# EAGLE design Bottom (EAGLE 9.3.0)

## Sheet 1 of 2: Power Supply
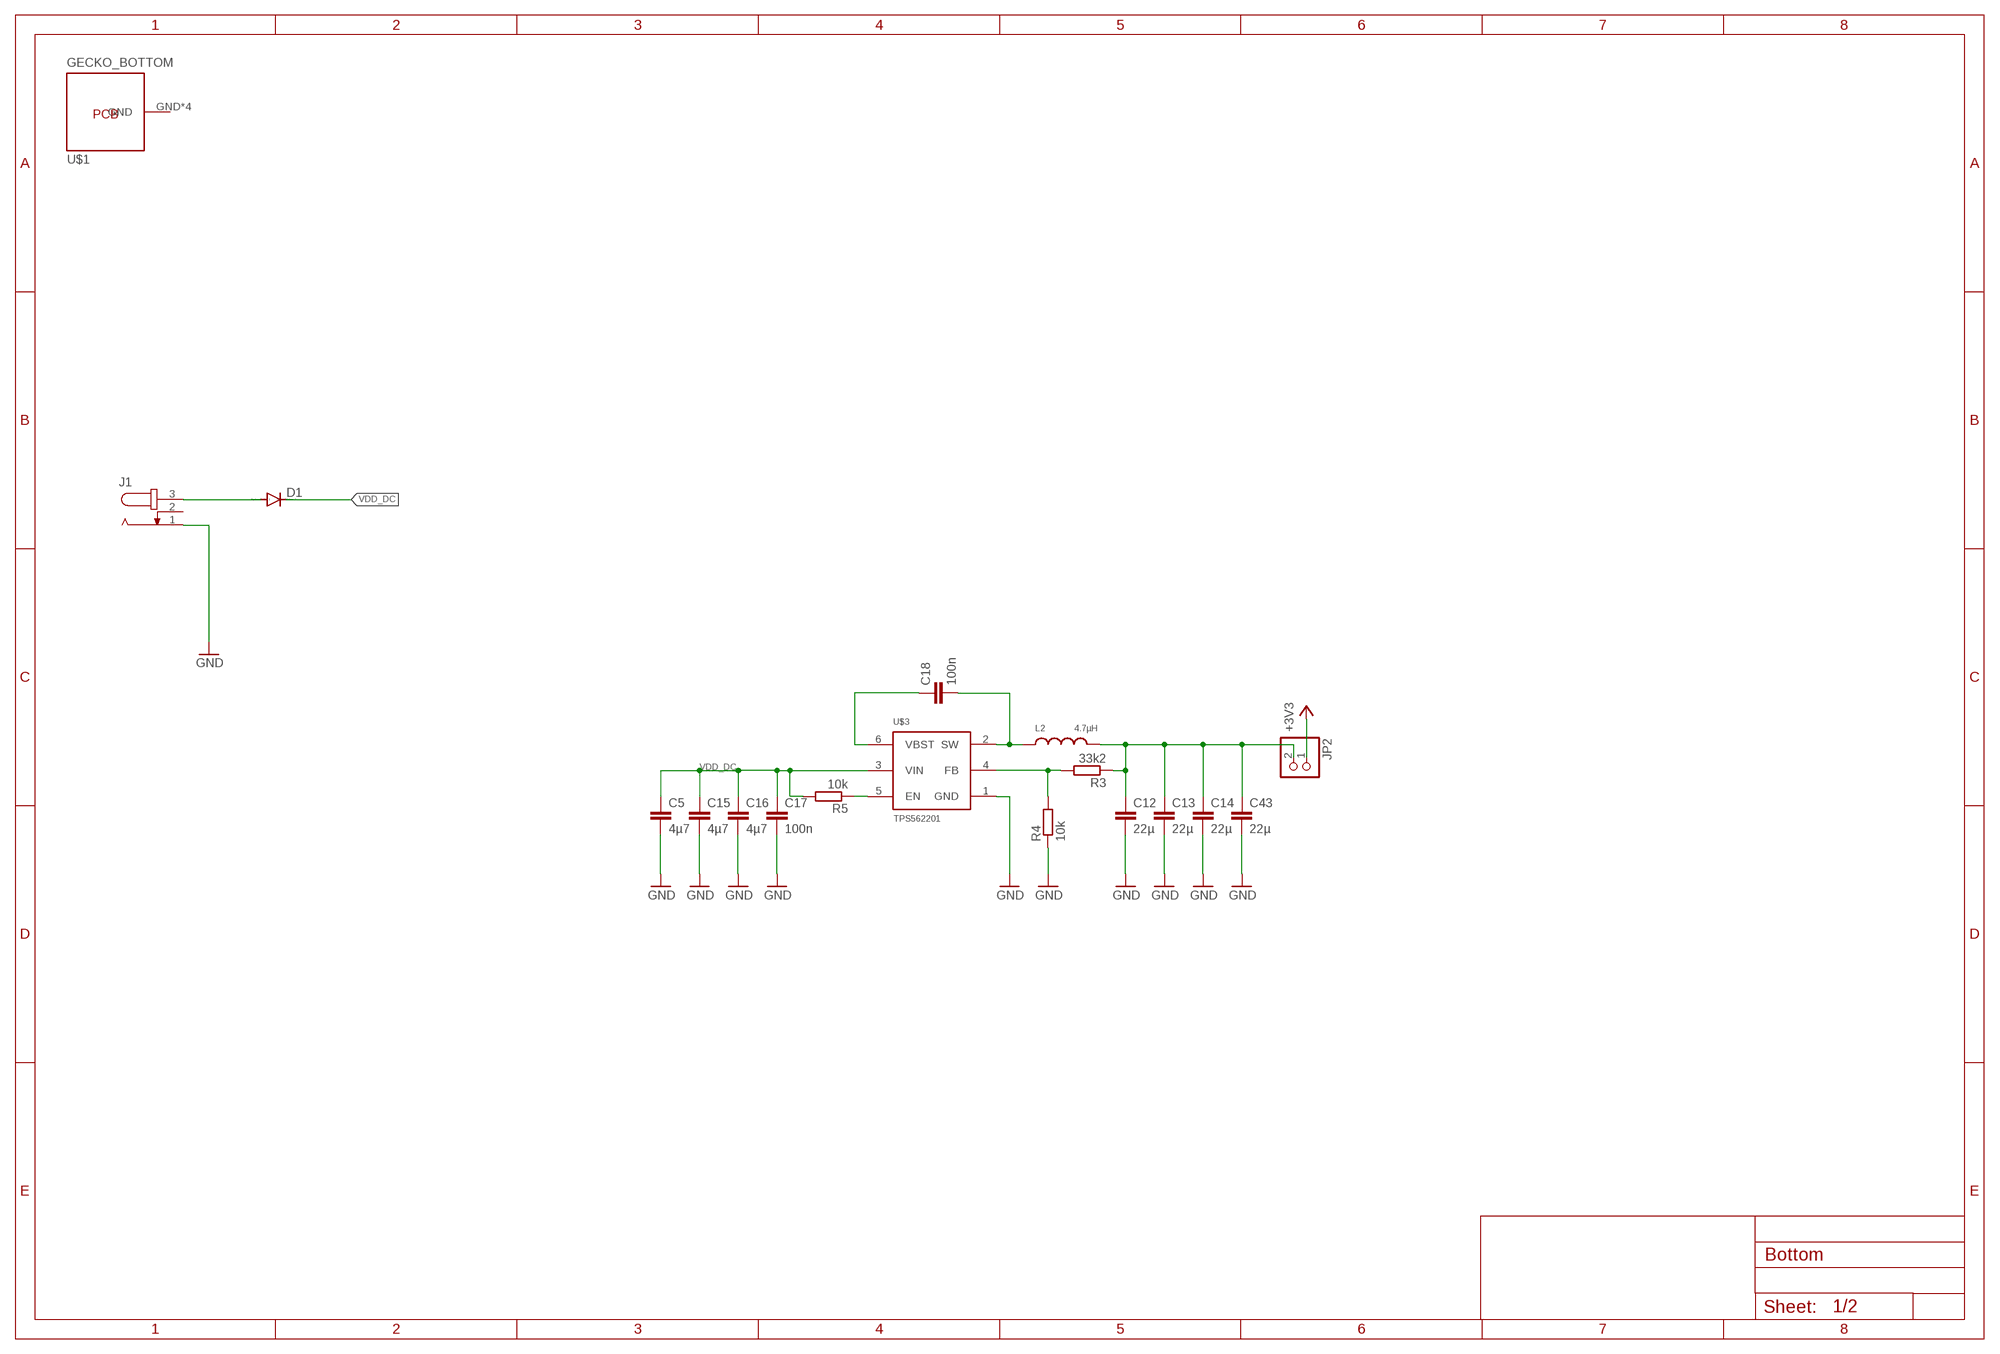
[diagram p0: schematic, sheet 1]

### Parts
C5  4µ7  C-EUC0805  [C0805]
C12  22µ  C-EUC0805  [C0805]
C13  22µ  C-EUC0805  [C0805]
C14  22µ  C-EUC0805  [C0805]
C15  4µ7  C-EUC0805  [C0805]
C16  4µ7  C-EUC0805  [C0805]
C17  100n  C-EUC0805  [C0805]
C18  100n  C-EUC0805  [C0805]
C43  22µ  C-EUC0805  [C0805]
D1  DIODE-SMB  [SMB]
J1  JACK-PLUG0  [SPC4077]
JP2  PINHD-1X2  [1X02]
L2  4.7µH  WE-MAPI_3020_74438336047  [WE-MAPI_3015/3020]
R3  33k2  R-EU_R0805  [R0805]
R4  10k  R-EU_R0805  [R0805]
R5  10k  R-EU_R0805  [R0805]
U$1  GECKO_BOTTOM  [GECKO_BOTTOM]
U$3  TPS562201  [SOT95P280X110-6]

### Nets
+3V3: JP2.1 ; also sheet 2
GND: C5.2 C12.2 C13.2 C14.2 C15.2 C16.2 C17.2 C43.2 J1.1 R4.1 U$3.1(GND) ; also sheet 2
N$7: D1.A J1.3
N$15: C18.1 U$3.6(VBST)
N$19: C18.2 L2.1 U$3.2(SW)
N$20: R3.2 R4.2 U$3.4(FB)
N$31: C12.1 C13.1 C14.1 C43.1 JP2.2 L2.2 R3.1
VDD_DC: C5.1 C15.1 C16.1 C17.1 D1.C R5.2 U$3.3(VIN)
VREG_VDD3V3_EN: R5.1 U$3.5(EN)
Unconnected: J1.2 U$1.GND U$1.GND1(GND) U$1.GND2(GND) U$1.GND3(GND)

## Sheet 2 of 2
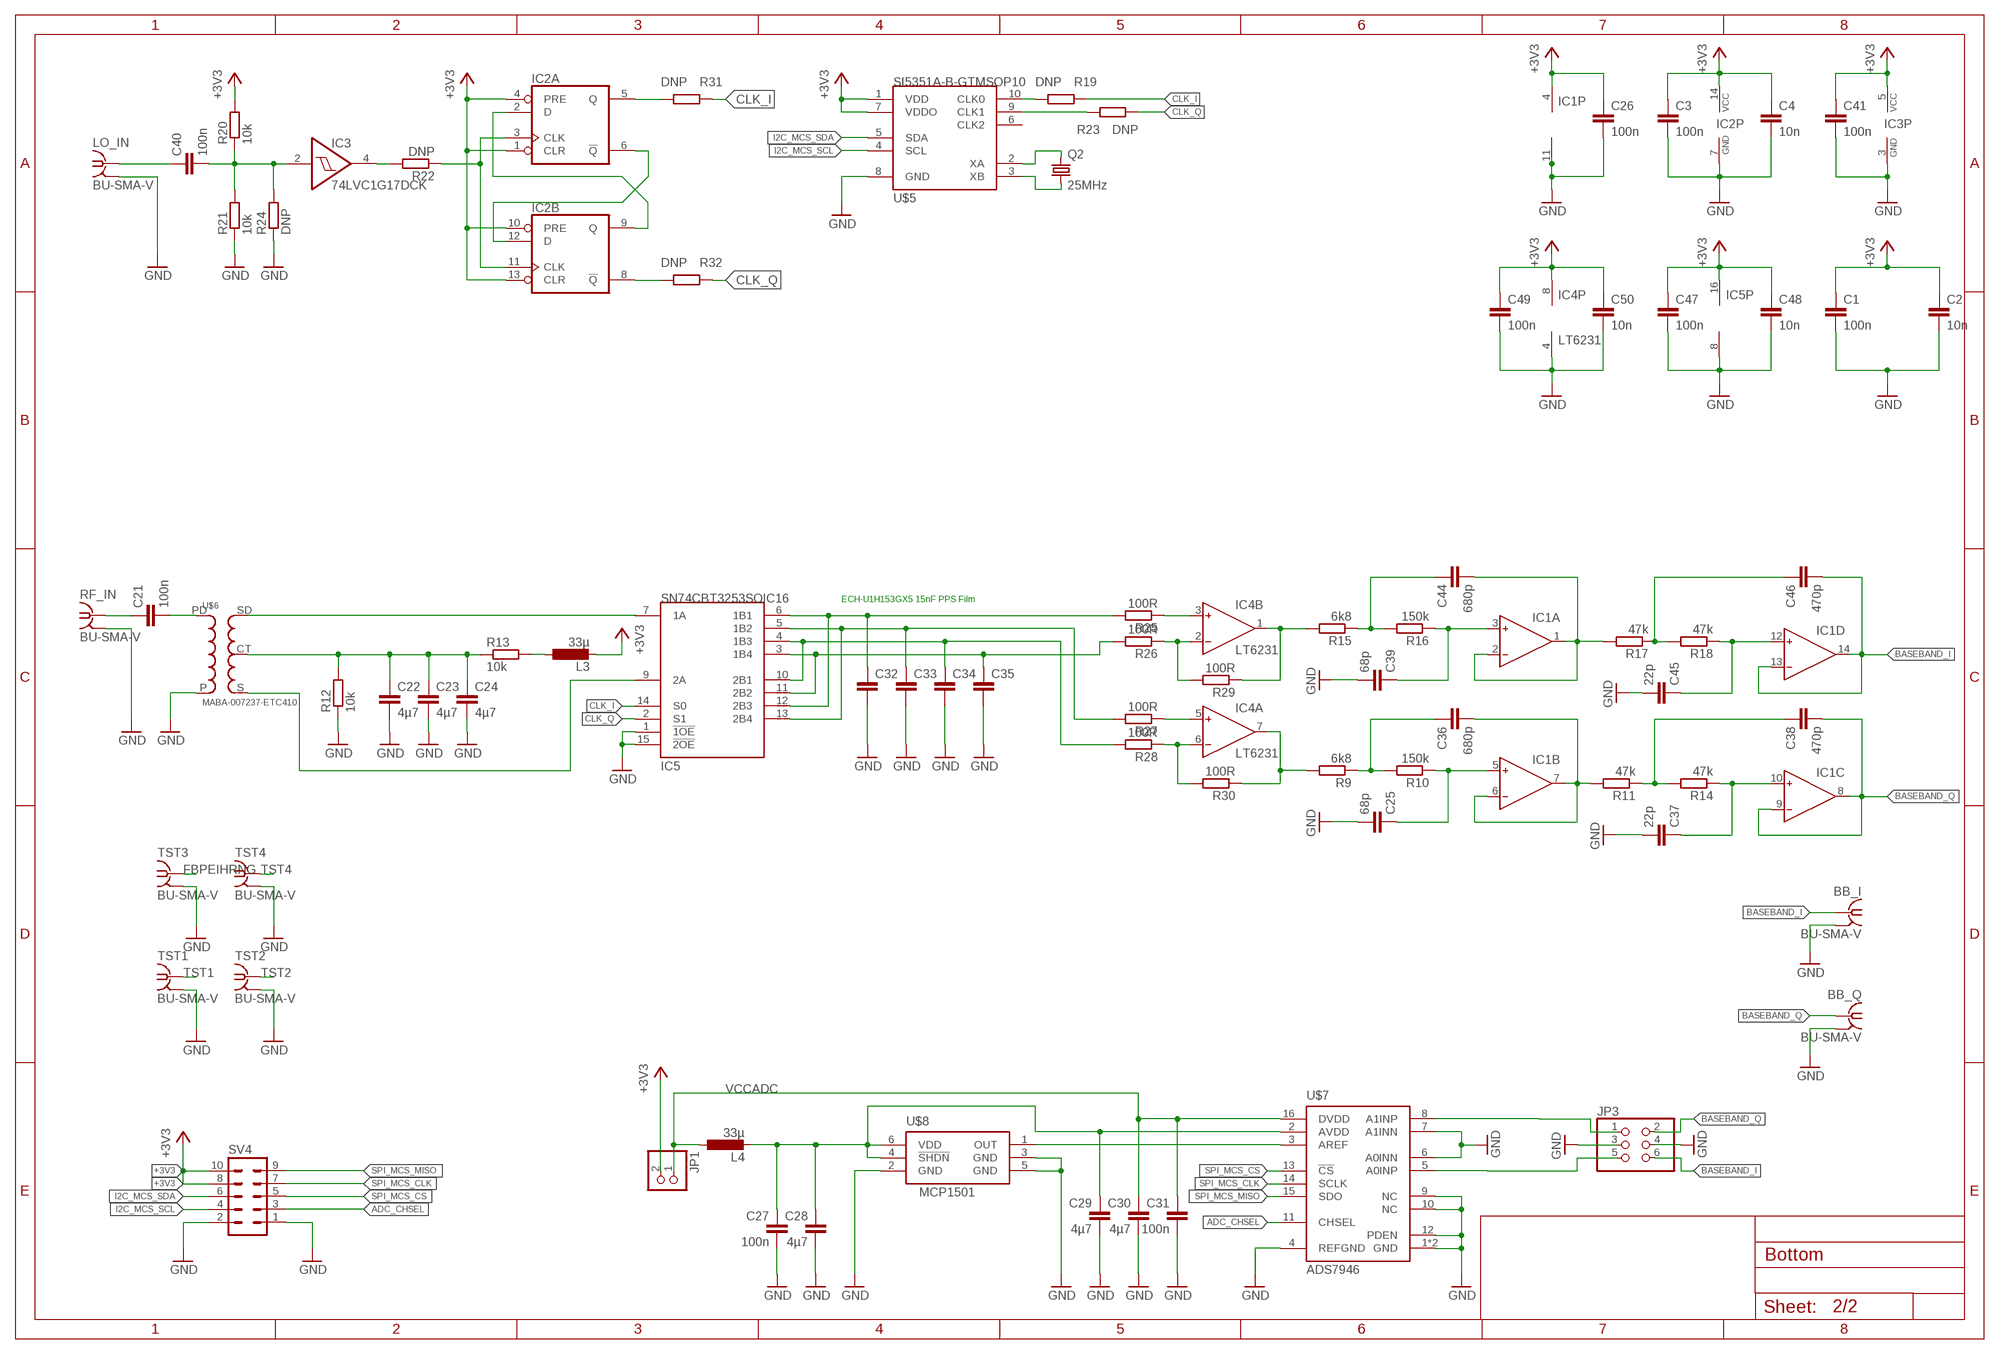
[diagram p1: schematic, sheet 2]

### Parts
BB_I  BU-SMA-V  [BU-SMA-V]
BB_Q  BU-SMA-V  [BU-SMA-V]
C1  100n  C-EUC0603  [C0603]
C2  10n  C-EUC0603  [C0603]
C3  100n  C-EUC0603  [C0603]
C4  10n  C-EUC0603  [C0603]
C21  100n  C-EUC0603  [C0603]
C22  4µ7  C-EUC0805  [C0805]
C23  4µ7  C-EUC0805  [C0805]
C24  4µ7  C-EUC0805  [C0805]
C25  68p  C-EUC0603  [C0603]
C26  100n  C-EUC0603  [C0603]
C27  100n  C-EUC0603  [C0603]
C28  4µ7  C-EUC0805  [C0805]
C29  4µ7  C-EUC0805  [C0805]
C30  4µ7  C-EUC0805  [C0805]
C31  100n  C-EUC0603  [C0603]
C32  C-EUC1206  [C1206]
C33  C-EUC1206  [C1206]
C34  C-EUC1206  [C1206]
C35  C-EUC1206  [C1206]
C36  680p  C-EUC0603  [C0603]
C37  22p  C-EUC0603  [C0603]
C38  470p  C-EUC0603  [C0603]
C39  68p  C-EUC0603  [C0603]
C40  100n  C-EUC0603  [C0603]
C41  100n  C-EUC0603  [C0603]
C44  680p  C-EUC0603  [C0603]
C45  22p  C-EUC0603  [C0603]
C46  470p  C-EUC0603  [C0603]
C47  100n  C-EUC0603  [C0603]
C48  10n  C-EUC0603  [C0603]
C49  100n  C-EUC0603  [C0603]
C50  10n  C-EUC0603  [C0603]
IC1  OP491SOIC_N14  [SOIC127P600X155-14]
IC2  74AC74D  [SO14]
IC3  74LVC1G17DCK  [SC70-5]
IC4  LT6231  [SO8]
IC5  SN74CBT3253SOIC16  [SOIC127P600X175-16]
JP1  PINHD-1X2  [1X02]
JP3  PINHD-2X3  [2X03]
L3  33µ  L-EUL2012C  [L2012C]
L4  33µ  L-EUL2012C  [L2012C]
LO_IN  BU-SMA-V  [BU-SMA-V]
Q2  25MHz  ABM10W-25.0000MHZ-6-B1U-T3  [ABM10W]
R9  6k8  R-EU_R0603  [R0603]
R10  150k  R-EU_R0603  [R0603]
R11  47k  R-EU_R0603  [R0603]
R12  10k  R-EU_R0603  [R0603]
R13  10k  R-EU_R0603  [R0603]
R14  47k  R-EU_R0603  [R0603]
R15  6k8  R-EU_R0603  [R0603]
R16  150k  R-EU_R0603  [R0603]
R17  47k  R-EU_R0603  [R0603]
R18  47k  R-EU_R0603  [R0603]
R19  DNP  R-EU_R0603  [R0603]
R20  10k  R-EU_R0603  [R0603]
R21  10k  R-EU_R0603  [R0603]
R22  DNP  R-EU_R0603  [R0603]
R23  DNP  R-EU_R0603  [R0603]
R24  DNP  R-EU_R0603  [R0603]
R25  100R  R-EU_R0603  [R0603]
R26  100R  R-EU_R0603  [R0603]
R27  100R  R-EU_R0603  [R0603]
R28  100R  R-EU_R0603  [R0603]
R29  100R  R-EU_R0603  [R0603]
R30  100R  R-EU_R0603  [R0603]
R31  DNP  R-EU_R0603  [R0603]
R32  DNP  R-EU_R0603  [R0603]
RF_IN  BU-SMA-V  [BU-SMA-V]
SV4  MA05-2  [MA05-2]
TST1  BU-SMA-V  [BU-SMA-V]
TST2  BU-SMA-V  [BU-SMA-V]
TST3  BU-SMA-V  [BU-SMA-V]
TST4  BU-SMA-V  [BU-SMA-V]
U$5  SI5351A-B-GTMSOP10  [SOP50P490X110-10]
U$6  MABA-007237-ETC410  [MABA-007237-ETC410]
U$7  ADS7946  [QFN50P300X300X80-17T170]
U$8  MCP1501  [SOT95P280X110-6]

### Nets
+3V3: C1.1 C2.1 C3.1 C4.1 C26.1 C41.1 C47.1 C48.1 C49.1 C50.1 IC1.4(P:V+) IC2.1(A:CLR) IC2.4(A:PRE) IC2.10(B:PRE) IC2.13(B:CLR) IC2.14(P:VCC) IC3.5(VCC) IC4.8(P:V+) IC5.16(V+) JP1.2 L3.2 R20.2 SV4.8 SV4.10 U$5.1(VDD) U$5.7(VDDO) ; also sheet 1
ADC_CHSEL: SV4.3 U$7.11(CHSEL)
BASEBAND_I: BB_I.1 C46.2 IC1.13(D:IN-) IC1.14(D:OUT) JP3.6
BASEBAND_Q: BB_Q.1 C38.2 IC1.8(C:OUT) IC1.9(C:IN-) JP3.2
CLK_I: IC5.14(S0) R19.1 R31.1
CLK_Q: IC5.2(S1) R23.1 R32.1
FBPEIHRNG: TST3.1
GND: BB_I.2 BB_I.3 BB_I.4 BB_I.5 BB_Q.2 BB_Q.3 BB_Q.4 BB_Q.5 C1.2 C2.2 C3.2 C4.2 C22.2 C23.2 C24.2 C25.2 C26.2 C27.2 C28.2 C29.2 C30.2 C31.2 C32.2 C33.2 C34.2 C35.2 C37.2 C39.2 C41.2 C45.2 C47.2 C48.2 C49.2 C50.2 IC1.11(P:V-) IC2.7(P:GND) IC3.3(GND) IC4.4(P:V-) IC5.1(!1OE) IC5.8(V-) IC5.15(!2OE) JP3.3 JP3.4 LO_IN.2 LO_IN.3 LO_IN.4 LO_IN.5 R12.1 R21.1 R24.1 RF_IN.2 RF_IN.3 RF_IN.4 RF_IN.5 SV4.1 SV4.2 TST1.2 TST1.3 TST1.4 TST1.5 TST2.2 TST2.3 TST2.4 TST2.5 TST3.2 TST3.3 TST3.4 TST3.5 TST4.2 TST4.3 TST4.4 TST4.5 U$5.8(GND) U$6.P U$7.1(GND) U$7.4(REFGND) U$7.6(A0INN) U$7.7(A1INN) U$7.9(NC) U$7.10(NC) U$7.12(PDEN) U$7.17(GND) U$8.2(GND) U$8.3(GND) U$8.5(GND) ; also sheet 1
I2C_MCS_SCL: SV4.4 U$5.4(SCL)
I2C_MCS_SDA: SV4.6 U$5.5(SDA)
N$1: R19.2 U$5.10(CLK0)
N$2: IC2.3(A:CLK) IC2.11(B:CLK) R22.1
N$3: IC2.6(A:!Q) IC2.12(B:D)
N$4: IC2.2(A:D) IC2.9(B:Q)
N$5: R23.2 U$5.9(CLK1)
N$6: IC4.7(A:OUT) R9.2 R30.1
N$10: C36.1 R9.1 R10.2
N$13: C25.1 IC1.5(B:IN+) R10.1
N$14: C36.2 IC1.6(B:IN-) IC1.7(B:OUT) R11.2
N$16: C21.1 RF_IN.1
N$17: C21.2 U$6.PD
N$18: C22.1 C23.1 C24.1 R12.2 R13.1 U$6.CT
N$21: L3.1 R13.2
N$22: IC4.3(B:IN+) R25.1
N$24: C32.1 IC5.6(1B1) IC5.12(2B3) R25.2
N$26: JP3.1 U$7.8(A1INP)
N$27: U$7.3(AREF) U$8.1(OUT)
N$29: C27.1 C28.1 C29.1 L4.2 U$7.2(AVDD) U$8.4(!SHDN) U$8.6(VDD)
N$32: JP3.5 U$7.5(A0INP)
N$33: C38.1 R11.1 R14.2
N$34: C34.1 IC5.4(1B3) IC5.10(2B1) R28.2
N$39: C37.1 IC1.10(C:IN+) R14.1
N$40: IC4.2(B:IN-) R26.1 R29.2
N$41: Q2.1 U$5.3(XB)
N$42: C44.1 R15.1 R16.2
N$43: C39.1 IC1.3(A:IN+) R16.1
N$44: C44.2 IC1.1(A:OUT) IC1.2(A:IN-) R17.2
N$45: IC4.5(A:IN+) R27.1
N$46: C40.1 LO_IN.1
N$47: C40.2 IC3.2(I) R20.1 R21.2 R24.2
N$48: IC3.4(O) R22.2
N$50: C46.1 R17.1 R18.2
N$51: IC5.9(2A) U$6.S
N$52: IC5.7(1A) U$6.SD
N$54: C45.1 IC1.12(D:IN+) R18.1
N$55: IC4.6(A:IN-) R28.1 R30.2
N$56: Q2.3 U$5.2(XA)
N$57: IC4.1(B:OUT) R15.2 R29.1
N$58: IC2.8(B:!Q) R32.2
N$59: IC2.5(A:Q) R31.2
N$128: C35.1 IC5.3(1B4) IC5.11(2B2) R26.2
N$130: C33.1 IC5.5(1B2) IC5.13(2B4) R27.2
SPI_MCS_CLK: SV4.7 U$7.14(SCLK)
SPI_MCS_CS: SV4.5 U$7.13(!CS)
SPI_MCS_MISO: SV4.9 U$7.15(SDO)
TST1: TST1.1
TST2: TST2.1
TST4: TST4.1
VCCADC: C30.1 C31.1 JP1.1 L4.1 U$7.16(DVDD)
Unconnected: U$5.6(CLK2)

### Notes on the sheet
- ECH-U1H153GX5 15nF PPS Film

## Library data of the parts
BB_I BB_Q LO_IN RF_IN TST1-TST4 = con-coax:BU-SMA-V: FEMALE SMA CONNECTOR Radiall distributor RS 112-3794; OC_FARNELL: unknown; OC_NEWARK: unknown
C1-C5 C12-C18 C21-C41 C43-C50 = rcl:C-EU: CAPACITOR, European symbol; SPICEPREFIX: C
D1 = diode:DIODE-: DIODE
IC1 = MyLib:OP491
IC2 = 74xx-eu:74*74: Dual D type positive edge triggered FLIP FLOP, preset and clear
IC3 = 74xx-little-de:74*1G17: Single Schmitt-Trigger Buffer
IC4 = MyLib:LT6231
IC5 = MyLib:SN74CBT3253
J1 = con-jack:JACK-PLUG: DC POWER JACK Power Jack, DC, Right Angle, Through Hole, Rated 5A at 16VDC, PC Terminals Distributor: Farnell (www.Farnell.de) Drawing: 84N1161.pdf / 84N1162.pdf Manufacturer: SPC Technology (www.spctechnology.com) Type: SPC4077 / SPC 4078; OC_FARNELL: unknown; OC_NEWARK: unknown
JP1 JP2 = pinhead:PINHD-1X2: PIN HEADER
JP3 = pinhead:PINHD-2X3: PIN HEADER
L2 = PowerMagnetics (rev18d):WE-MAPI_3020: SMD Metal Alloy Power Inductor Characteristics Magnetic iron alloy allows high rated currents Compact design Magnetically shielded High current capability and handles high transient current spikes Low acoustic noise and low leakage flux noise Operating temperature: –40 °C to 125 °C Applications DC/DC-converter for high current power supplies DC/DC-converter for Field Programmable Gate Array (FPGA) POL-converters Portable power like PDA, digital camera Mainboards/graphic cards Battery powered devices Wireless communication devices Power supplies for smartphones, tablet PCs and other mobile devices <http://katalog.we-online.de/media/images/v2/Family_WE-MAPI.jpg> Details see: http://katalog.we-online.de/en/pbs/WE-MAPI? Updated by Dan Xu 2014-07-08 2014 (C) Wurth Elektronik; WE-NUMBER: 74438336047/4,7uH
L3 L4 = rcl:L-EU: INDUCTOR, European symbol; SPICEPREFIX: L
Q2 = MyLib:ABM10W-25.0000MHZ-6-B1U-T3
R3-R5 R9-R32 = rcl:R-EU_: RESISTOR, European symbol; SPICEPREFIX: R
SV4 = con-lstb:MA05-2: PIN HEADER; OC_FARNELL: unknown; OC_NEWARK: unknown
U$1 = MyLib:GECKO_BOTTOM
U$3 = MyLib:TPS562201
U$5 = MyLib:SI5351A-B-GT
U$6 = MyLib:MABA-007237-ETC410
U$7 = MyLib:ADS7946
U$8 = MyLib:MCP1501

## Board
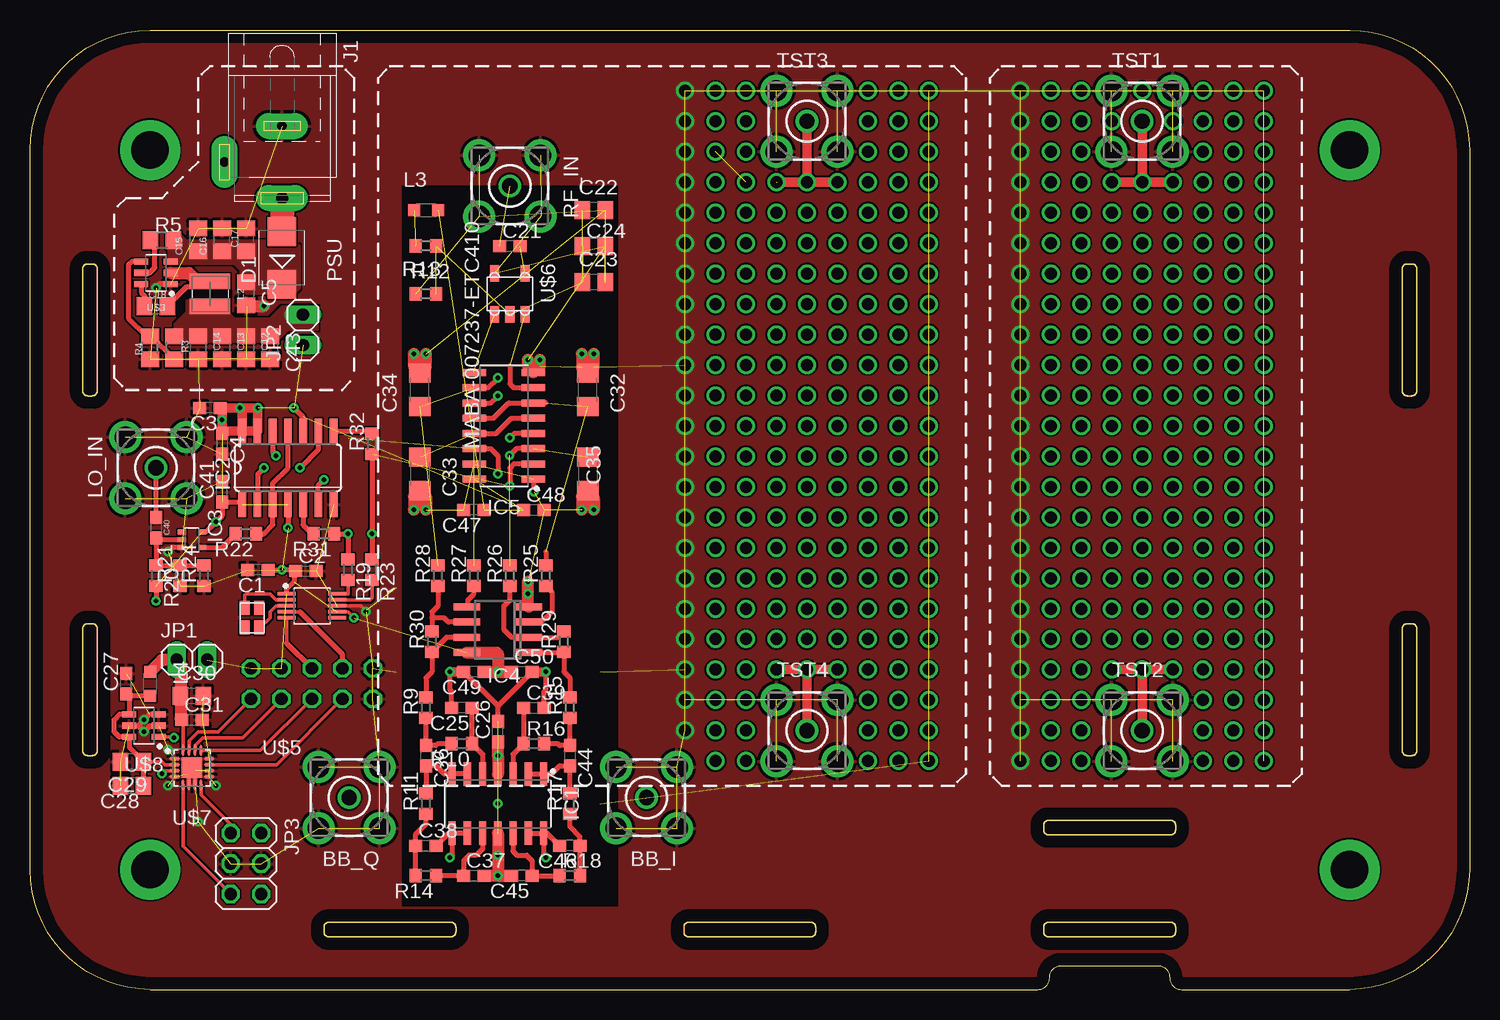
[diagram p2: board, top side]
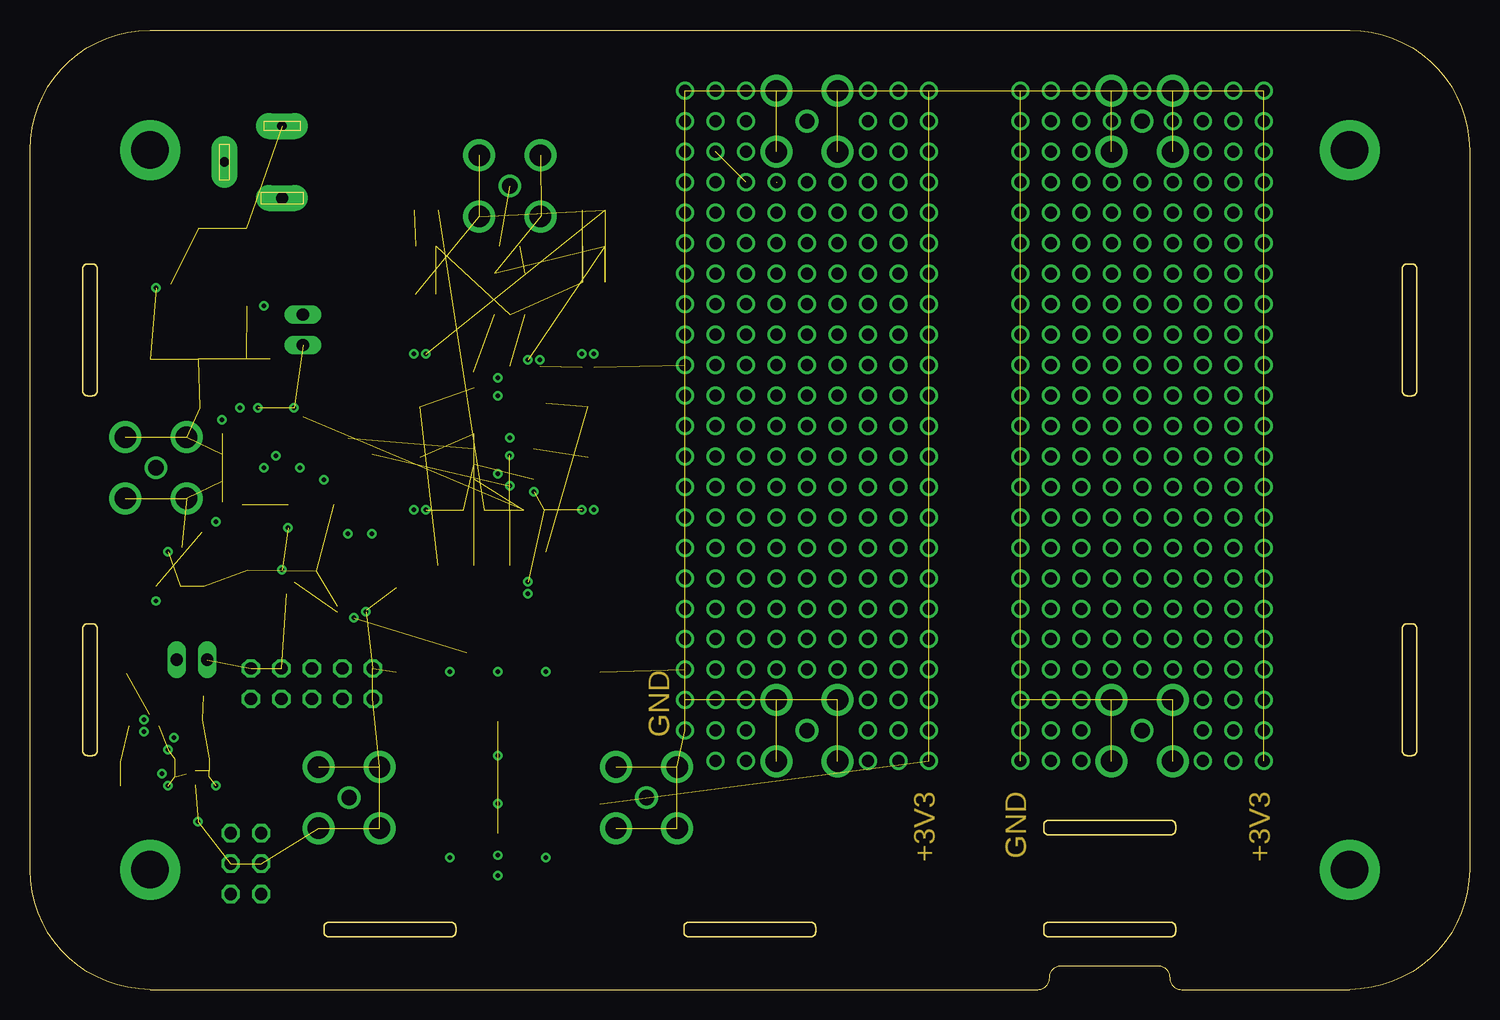
[diagram p3: board, inner layer Route2]
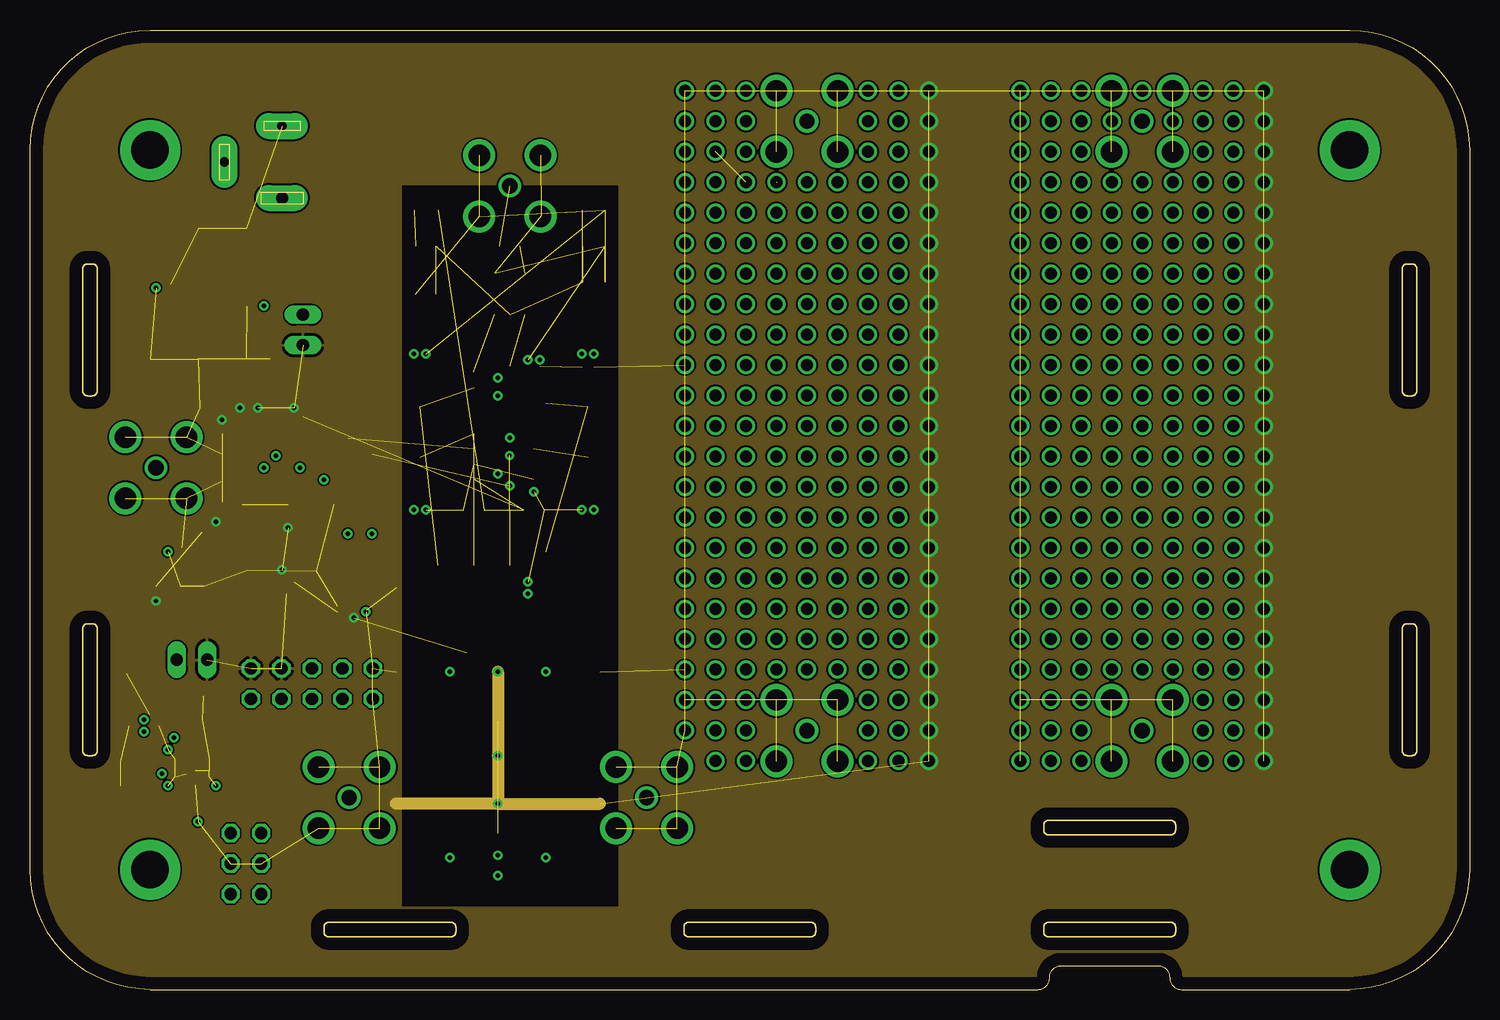
[diagram p4: board, inner layer Route15]
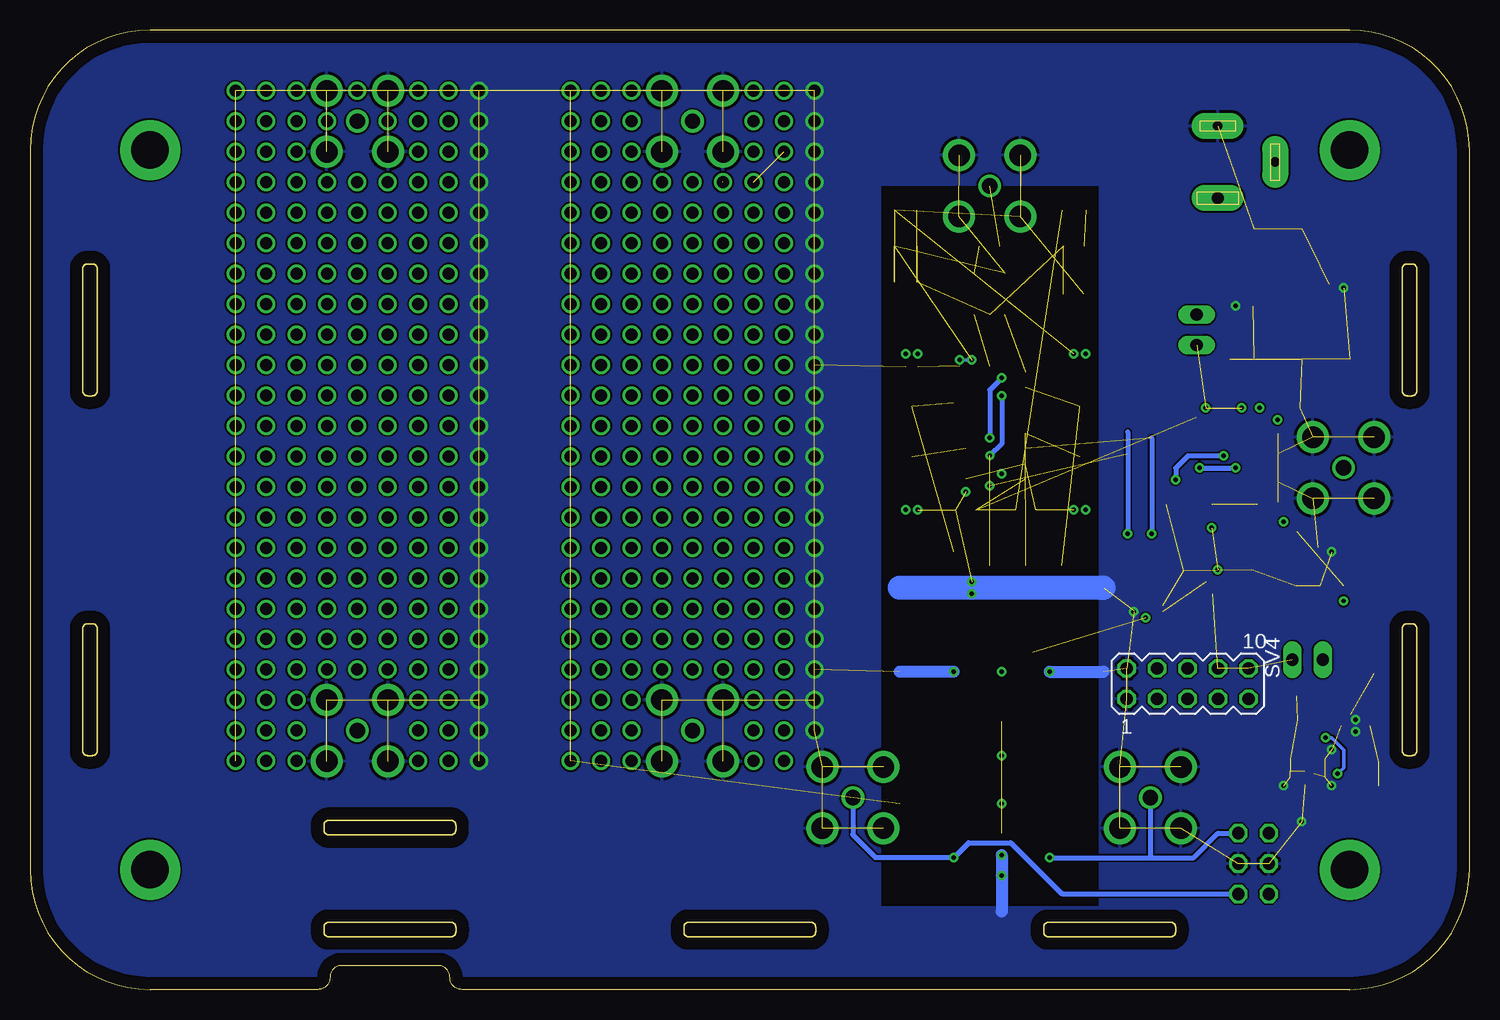
[diagram p5: board, bottom side, seen from below]

Size 120 x 80 mm. Coordinates in mm from the lower left corner, seen from the top.
Copper layers ([2:1+2*15+16:15]): Top 0.035mm / dielectric 1.5mm / Route2 0.035mm / dielectric 0.15mm / Route15 0.035mm / dielectric 0.2mm / Bottom 0.035mm
Design rules "default *": minimum track width 6mil, minimum drill 0.35mm, track to track 6mil, track to pad 6mil, pad to pad 6mil, via to via 6mil, smd to smd 6mil, copper to edge 40mil, drill to drill 6mil, minimum pad ring 10mil, minimum via ring 8mil, stop-mask expansion 4mil, vias tented up to drill 0mil, thermal gap 10mil

### Footprints (pad centres in the part's own frame; a part is rotated, then mirrored left to right if it is on the bottom)
BU-SMA-V = drill 1.27: 1 0,0 | drill 1.778: 2 -2.55,2.55; 3 2.55,2.55; 4 2.55,-2.55; 5 -2.55,-2.55
C0603 = smd 1.1 x 1: 1 -0.85,0; 2 0.85,0
C0805 = smd 1.3 x 1.5: 1 -0.95,0; 2 0.95,0
C1206 = smd 1.6 x 1.8: 1 -1.4,0; 2 1.4,0
SMB = smd 2.4 x 2.4: A 2.2,0; C -2.2,0
SOIC127P600X155-14 = smd 1.968 x 0.599: 1 -2.473,3.81; 2 -2.473,2.54; 3 -2.473,1.27; 4 -2.473,0; 5 -2.473,-1.27; 6 -2.473,-2.54; 7 -2.473,-3.81; 8 2.473,-3.81; 9 2.473,-2.54; 10 2.473,-1.27; 11 2.473,0; 12 2.473,1.27; 13 2.473,2.54; 14 2.473,3.81
SO14 = smd 0.66 x 2.032: 1 -3.81,-3.073; 2 -2.54,-3.073; 3 -1.27,-3.073; 4 0,-3.073; 5 1.27,-3.073; 6 2.54,-3.073; 7 3.81,-3.073; 8 3.81,3.073; 9 2.54,3.073; 10 1.27,3.073; 11 0,3.073; 12 -1.27,3.073; 13 -2.54,3.073; 14 -3.81,3.073
SC70-5 = smd 0.4 x 0.7: 1 -0.65,-0.85; 2 0,-0.85; 3 0.65,-0.85; 4 0.65,0.85; 5 -0.65,0.85
SO8 = smd 0.6 x 2.2: 1 -1.905,-2.6; 2 -0.635,-2.6; 3 0.635,-2.6; 4 1.905,-2.6; 5 1.905,2.6; 6 0.635,2.6; 7 -0.635,2.6; 8 -1.905,2.6
SOIC127P600X175-16 = smd 1.968 x 0.599: 1 -2.473,4.445; 2 -2.473,3.175; 3 -2.473,1.905; 4 -2.473,0.635; 5 -2.473,-0.635; 6 -2.473,-1.905; 7 -2.473,-3.175; 8 -2.473,-4.445; 9 2.473,-4.445; 10 2.473,-3.175; 11 2.473,-1.905; 12 2.473,-0.635; 13 2.473,0.635; 14 2.473,1.905; 15 2.473,3.175; 16 2.473,4.445
SPC4077 = drill 0.8 pad 2.184 long: 1 -3,0; 2 0,-4.8 | drill 1 pad 2.184 long: 3 3,0
1X02 = drill 1.016 long: 1 -1.27,0; 2 1.27,0
2X03 = drill 1.016 octagon: 1 -2.54,-1.27; 2 -2.54,1.27; 3 0,-1.27; 4 0,1.27; 5 2.54,-1.27; 6 2.54,1.27
WE-MAPI_3015/3020 = smd 1.3 x 3.4: 1 -1.05,0; 2 1.05,0
L2012C = smd 1 x 1: 1 -1,0; 2 1,0
ABM10W = smd 1.2 x 0.85: 1 -0.812,-0.6; 3 0.812,0.6; GND@1 -0.812,0.6; GND@2 0.812,-0.6
R0805 = smd 1.3 x 1.5: 1 -0.95,0; 2 0.95,0
R0603 = smd 1 x 1.1: 1 -0.85,0; 2 0.85,0
MA05-2 = drill 1.016 octagon: 1 -5.08,-1.27; 2 -5.08,1.27; 3 -2.54,-1.27; 4 -2.54,1.27; 5 0,-1.27; 6 0,1.27; 7 2.54,-1.27; 8 2.54,1.27; 9 5.08,-1.27; 10 5.08,1.27
GECKO_BOTTOM = drill 3.1 pad 5: GND -50,30; GND1 -50,-30; GND2 50,-30; GND3 50,30
SOT95P280X110-6 = smd 1.16 x 0.51: 1 -1.22,0.95; 2 -1.22,0; 3 -1.22,-0.95; 4 1.22,-0.95; 5 1.22,0; 6 1.22,0.95
SOP50P490X110-10 = smd 1.503 x 0.325: 1 -2.104,1; 2 -2.104,0.5; 3 -2.104,0; 4 -2.104,-0.5; 5 -2.104,-1; 6 2.104,-1; 7 2.104,-0.5; 8 2.104,0; 9 2.104,0.5; 10 2.104,1
MABA-007237-ETC410 = smd 0.762 x 1.397: CT 0,1.714; P 1.27,-1.714; PD -1.27,-1.714; S 1.27,1.714; SD -1.27,1.714
QFN50P300X300X80-17T170 = smd 0.896 x 0.264: 1 -1.437,0.75; 2 -1.437,0.25; 3 -1.437,-0.25; 4 -1.437,-0.75; 9 1.437,-0.75; 10 1.437,-0.25; 11 1.437,0.25; 12 1.437,0.75 | smd 0.264 x 0.896: 5 -0.75,-1.437; 6 -0.25,-1.437; 7 0.25,-1.437; 8 0.75,-1.437; 13 0.75,1.437; 14 0.25,1.437; 15 -0.25,1.437; 16 -0.75,1.437 | smd 1.7 x 1.7: 17 0,0

### Placement (x,y rotation side)
BB_I  51.4,16 180 top
BB_Q  26.6,16 180 top
C1  19,35 180 top
C2  23,34.9 0 top
C3  15,48.5 180 top
C4  16,45.5 270 top
C5  18,58 270 top
C12  18,53.5 270 top
C13  16,53.5 270 top
C14  14,53.5 270 top
C15  14,62.5 90 top
C16  16,62.5 90 top
C17  18,62.5 90 top
C18  10.5,57 0 top
C21  40,62 0 top
C22  47,65 0 top
C23  47,59 0 top
C24  47,62 0 top
C25  36,23.5 180 top
C26  39,21.5 90 top
C27  8,25.5 90 top
C28  8.5,17 180 top
C29  8.5,19 180 top
C30  13.5,24.5 0 top
C31  13.5,22.5 0 top
C32  46.5,50 90 top
C33  32.5,43 270 top
C34  32.5,50 90 top
C35  46.5,43 270 top
C36  33,19.5 270 top
C37  37,9.5 0 top
C38  33,12 0 top
C39  42,23.5 0 top
C40  10.5,38.5 270 top
C41  16,41.5 90 top
C43  20,53.5 270 top
C44  45,19.5 270 top
C45  41,9.5 180 top
C46  45,12 180 top
C47  37,40 180 top
C48  42,40 0 top
C49  37,26.5 180 top
C50  41,26.5 0 top
D1  21,61 90 top
IC1  39,15.5 270 top
IC2  21.5,43.5 0 top
IC3  13.5,37.5 270 top
IC4  39,30 90 top
IC5  39.5,47 180 top
J1  21,69 270 top
JP1  13.5,27.5 0 top
JP2  22.75,55 90 top
JP3  18,10.5 270 top
L2  15,58 270 top
L3  33,65 0 top
L4  10,25.5 270 top
LO_IN  10.5,43.5 90 top
Q2  18.5,31 90 top
R3  12,53.5 270 top
R4  10,53.5 90 top
R5  11,62.5 0 top
R9  33,23.5 90 top
R10  36,20.5 180 top
R11  33,15.5 90 top
R12  33,58 0 top
R13  33,62 180 top
R14  33,9.5 180 top
R15  45,23.5 90 top
R16  42,20.5 0 top
R17  45,15.5 90 top
R18  45,9.5 0 top
R19  26.5,35 270 top
R20  10.5,34.5 270 top
R21  12.5,34.5 90 top
R22  18,38 180 top
R23  28.5,35 270 top
R24  14.5,34.5 90 top
R25  43,34.5 90 top
R26  40,34.5 90 top
R27  37,34.5 90 top
R28  34,34.5 90 top
R29  44.5,29 90 top
R30  33.5,29 90 top
R31  24.5,38 180 top
R32  28.5,45.5 90 top
RF_IN  40,67 270 top
SV4  23.5,25.5 0 bottom
TST1  92.71,72.39 0 top
TST2  92.71,21.59 0 top
TST3  64.77,72.39 0 top
TST4  64.77,21.59 0 top
U$1  60,40 0 top
U$3  10.5,59.75 180 top
U$5  23.5,32 0 top
U$6  40,58 180 top
U$7  13.5,18.5 0 top
U$8  9.5,22 180 top

### Tracks (layer width: path | path; a pad name or v marks a point on that pad's centre or on a via)
+3V3  (via drill 0.35, 1)  (61 unrouted)
  Top 0.3: U$5.1 21.39,33.02
  Top 0.305: v27,31 26.5,31.5 U$5.7
  Top 0.4: 39,20 C26.1 | IC2.14 arc90 17.61,46.65 | 18.96,48.46 v19,48.5 | IC2.10 22.77,47.73 v22,48.5 | R20.2 v10.5,32.4 | IC2.4 v21.5,38.5 | C1.1 v21,35 22.05,35 C2.1 22,34.75 22,34 21.39,33.4 21.39,33.02 | IC3.5 14.65,38.15 v15.5,39 16,39.5 C41.1 17.47,40.65 IC2.1
  Top 0.8: v17.5,48.5 C3.1 16,48.35 v16,47.5 C4.1 16.22,46.57 IC2.14 | v17.5,48.5 v19,48.5 | 18.96,48.46 IC2.13 IC2.14 | IC2.14 17.69,48.31 v17.5,48.5
  Top 1: 39,20 v39,19.5 IC1.4 | IC4.8 38.91,28.09 39,28 v39,26.5 | C49.1 v39,26.5 | v39,26.5 C50.1
  Route15 1: v39,15.5 30.5,15.5 | v39,15.5 47.5,15.5 | v39,26.5 v39,19.5 v39,15.5
  other vias: 102.87,64.77 102.87,62.23 102.87,59.69 102.87,57.15 102.87,54.61 102.87,52.07 102.87,49.53 102.87,44.45 102.87,46.99 102.87,41.91 102.87,39.37 102.87,36.83 102.87,34.29 102.87,31.75 102.87,29.21 102.87,26.67 102.87,24.13 102.87,21.59 102.87,19.05 102.87,74.93 102.87,67.31 102.87,69.85 102.87,72.39 74.93,26.67 74.93,24.13 74.93,21.59 74.93,19.05 74.93,64.77 74.93,62.23 74.93,59.69 74.93,57.15 74.93,54.61 74.93,52.07 74.93,49.53 74.93,44.45 74.93,46.99 74.93,41.91 74.93,39.37 74.93,36.83 74.93,34.29 74.93,31.75 74.93,29.21 74.93,74.93 74.93,72.39 74.93,69.85 74.93,67.31
  pour Route15: -1,74 6,81 114,81 121,74 121,6 114,-1 6,-1 -1,6
ADC_CHSEL
  Top 0.3: U$7.11 20.56,18.75 SV4.3
BASEBAND_I  (via drill 0.35)
  Top 0.4: IC1.13 IC1.14 | C46.2 43.12,13.03 IC1.14 | IC1.14 42.81,11.19 v43,11
  Bottom 0.4: BB_I.1 51.4,12.9 49.5,11 v43,11 41.75,12.25 38.25,12.25 34,8 19.31,8 JP3.6
BASEBAND_Q  (via drill 0.35)
  Top 0.4: C38.2 34.88,13.03 IC1.8 | IC1.9 IC1.8 | IC1.8 35.19,11.19 v35,11
  Bottom 0.4: v35,11 26.5,11 | 26.5,11 26.6,11.1 BB_Q.1 | 26.5,11 23,11 20.96,13.04 JP3.2
CLK_I  (via drill 0.35)  (1 unrouted)
  Top 0.4: IC5.14 38.41,45.09 39,44.5 v39,43 | R19.1 v26.5,38 R31.1
  Bottom 0.4: 26.5,46 v26.5,38
CLK_Q  (via drill 0.35)  (1 unrouted)
  Top 0.4: IC5.2 40.33,43.83 40,43.5 v40,42 | R23.1 v28.5,38 R32.1
  Bottom 0.4: 28.5,46.5 v28.5,38
FBPEIHRNG  (via drill 1)  (1 unrouted)
  Top 0.8: TST3.1 v64.77,67.31 | v64.77,67.31 62.26,67.31 | v64.77,67.31 v67.31,67.31
  other vias: 62.23,67.31
GND  (via drill 0.35, 1)  (134 unrouted)
  Top 0.3: v42.5,52.5 v41.5,52.5
  Top 0.305: v28,31.5 28,31.61 27.61,32 U$5.8
  Top 0.4: U$7.7 13.75,18.25 U$7.17 13,18 13.25,17.75 U$7.6 | IC5.1 41.97,41.53 v42,41.5 | U$8.3 9.95,22.95 v9.5,22.5 9,22 | U$8.2 10,22 v9.5,21.5 9,22 | U$8.5 9,22 | IC3.3 11.85,36.85 v11.5,36.5 | C25.2 35.15,24.85 35,25 v35,26.5 | C39.2 42.85,24.85 43,25 v43,26.5
  Top 0.406: C26.2 39,23.65 | 39,23.65 C49.2 | 39,23.65 C50.2
  Top 0.508: U$3.1 10.8,58.8 v10.5,58.5
  Top 0.8: C49.2 v35,26.5 | C50.2 v43,26.5
  Top 1: v46,40 46,41.1 C35.2 46.5,41.5 47,41 v47,40 | v33,53 33,51.9 C34.2 32.5,51.5 32,52 v32,53 | v32,40 32,41.1 C33.2 33,41.1 v33,40 | v47,53 47,51.9 C32.2 46,51.9 v46,53 | v41.5,52.5 41.5,52 41.97,51.53 IC5.8 41.97,51.47 42.5,52 v42.5,52.5 | IC4.4 41.5,32.01 v41.5,33 v41.5,34 | IC1.11 v39,11.2 v39,9.5 | v39,9.5 C37.2 | v39,9.5 C45.2 | C5.2 18.05,57 v19.5,57 | RF_IN.3 42.6,64.5
  Bottom 0.3: v41.5,52.5 42,52.5 | v41.5,34 41.5,33.5
  Bottom 1: v39,11.2 v39,9.5 39,6.5 | v35,26.5 30.5,26.5 | v43,26.5 47.5,26.5
  Bottom 2: 30.5,33.5 41.5,33.5 47.5,33.5
  other vias: 11.5,20 11.5,17 14,14 15.5,17 82.55,74.93 82.55,72.39 82.55,69.85 82.55,67.31 82.55,64.77 82.55,62.23 82.55,59.69 82.55,57.15 82.55,54.61 82.55,52.07 82.55,49.53 82.55,46.99 82.55,44.45 82.55,41.91 82.55,39.37 82.55,36.83 82.55,34.29 82.55,31.75 82.55,29.21 82.55,26.67 82.55,24.13 82.55,21.59 82.55,19.05 54.61,74.93 54.61,72.39 54.61,69.85 54.61,67.31 54.61,64.77 54.61,62.23 54.61,59.69 54.61,57.15 54.61,54.61 54.61,52.07 54.61,49.53 54.61,46.99 54.61,44.45 54.61,41.91 54.61,39.37 54.61,36.83 54.61,34.29 54.61,31.75 54.61,29.21 54.61,26.67 54.61,24.13 54.61,21.59
  pour Bottom (rank 2): -1,74 6,81 114,81 121,74 121,6 114,-1 6,-1 -1,6
  pour Top (rank 2): -1,74 6,81 114,81 121,74 121,6 114,-1 6,-1 -1,6
I2C_MCS_SCL
  Top 0.3: U$5.4 22.5,31.5
  Top 0.4: 22.5,31.5 26.04,27.96 SV4.4
I2C_MCS_SDA
  Top 0.3: U$5.5 21.39,28.88
  Top 0.4: 21.39,28.88 SV4.6
N$1
  Top 0.3: R19.2 26.5,33 U$5.10
N$2
  Top 0.4: IC2.11 21.5,43.5 20.23,42.23 IC2.3 20.23,38.73 19.5,38 R22.1
N$3  (via drill 0.35)
  Top 0.4: IC2.6 24.04,42.04 v24.5,42.5 | IC2.12 20.23,44.77 v20.5,44.5
  Bottom 0.4: v24.5,42.5 24.5,43.5 23.5,44.5 v20.5,44.5
N$4  (via drill 0.35)
  Top 0.4: IC2.9 24.04,45.04 v22.5,43.5 | IC2.2 19,40.47 19,43 v19.5,43.5
  Bottom 0.4: v22.5,43.5 v19.5,43.5
N$5
  Top 0.3: R23.2 28.5,32.65 28.35,32.5 27,32.5
  Top 0.305: U$5.9 27,32.5
N$6
  Top 0.4: IC4.7 34.72,29.36 R30.1 33.5,26.5 33,26 R9.2
N$7
  Top 2: J1.3 D1.A
N$8  (via drill 1)
  other vias: 57.15,34.29
N$9  (via drill 1)
  other vias: 59.69,34.29
N$10
  Top 0.4: R10.2 34,20.5 33.85,20.35 C36.1 R9.1
N$11  (via drill 1)
  other vias: 85.09,74.93
N$12  (via drill 1)
  other vias: 59.69,36.83
N$13
  Top 0.4: IC1.5 37.73,19.62 R10.1 C25.1
N$14
  Top 0.3: 33.2,18.65 C36.2
  Top 0.4: IC1.6 IC1.7 34.53,17.97 33.85,18.65 33.2,18.65 | C36.2 R11.2
N$15
  Top 0.4: U$3.6 9.28,58.12 9.55,57.85 C18.1
N$16  (1 unrouted)
N$17  (1 unrouted)
N$18  (5 unrouted)
N$19
  Top 0.4: C18.2 13.05,58.6 13.6,58.6 13.95,58.95 13.95,59.05
  Top 1: U$3.2 13.25,59.75 13.95,59.05 L2.1
N$20
  Top 0.4: U$3.4 8.5,60.7 8.2,60.4 8.2,56 9.75,54.45 R4.2 10.1,54.45 R3.2
N$21  (1 unrouted)
N$22
  Top 0.4: R25.1 43.5,33.15 43.5,31.5 42.63,30.64 IC4.3
N$24  (2 unrouted)
  Top 0.4: 43,36.5 R25.2 | 43.01,48.91 IC5.6 39.91,48.91 38.63,47.63 IC5.12
N$25  (via drill 1)
  other vias: 57.15,36.83
N$26
  Top 0.3: 14.25,16.25 14.25,16.85 14.25,16.86 U$7.8
  Top 0.305: JP3.1 16.73,13.77 14.25,16.25
N$27  (via drill 0.35)
  Top 0.3: U$8.1 11.95,21.05 v12,21 | U$7.3 11.25,18.25 v11,18
  Bottom 0.3: v12,21 11.5,21 10.5,20 10.5,18.5 v11,18
N$28  (via drill 1)
  other vias: 57.15,39.37
N$29
  Top 0.3: U$7.2 11.25,18.75 11,19 C29.1
  Top 0.4: L4.2 8.15,24.5 C27.1 8.28,24.37 U$8.4 7.45,22.95 7,22.5 7,21.5 7.45,21.05 U$8.6 8.28,20.17 C29.1 C28.1
N$30  (via drill 1)
  other vias: 87.63,74.93
N$31
  pour Top (no thermals): 12,54 20.5,54 21.5,55 24,55 24,57 21,57 20,56 17,56 16.5,56.5 16.5,57.5 13,57.5 13,56.5 12,55.5
N$32
  Top 0.305: U$7.5 12.75,11.94 JP3.5
N$33
  Top 0.4: R11.1 32.83,14.48 33,14.3 33,13.8 32.15,12.95 C38.1 R14.2
N$34  (via drill 0.35)  (2 unrouted)
  Top 0.4: C34.1 32.6,48.6 | IC5.4 40.37,46.37 v40,46 | IC5.10 38.17,50.17 v39,51
  Bottom 0.4: v40,46 40,50 v39,51
N$35  (via drill 1)
  other vias: 59.69,39.37
N$36  (via drill 1)
  other vias: 62.23,39.37
N$37  (via drill 1)
  other vias: 62.23,36.83
N$38  (via drill 1)
  other vias: 62.23,34.29
N$39
  Top 0.4: IC1.10 37.73,11.73 37.2,11.2 36.6,11.2 36.15,10.75 C37.1 R14.1
N$40
  Top 0.4: R29.2 44.02,29.36 IC4.2 40.13,29.36 39.5,30 39.5,32 40,32.5 R26.1
N$41
  Top 0.3: U$5.3 20.5,32 20,31.5 20,31 19.19,30.19 Q2.1
N$42
  Top 0.4: R16.2 44,20.5 44.15,20.35 C44.1 R15.1
N$43
  Top 0.4: IC1.3 40.27,19.62 R16.1 C39.1
N$44
  Top 0.4: R17.2 C44.2 44.15,18.65 43.47,17.97 IC1.1 IC1.2
N$45
  Top 0.4: IC4.5 36.5,32.01 36.5,32.5 37,33 R27.1
N$46
  Top 0.4: C40.1 LO_IN.1
N$47
  Top 0.4: IC3.2 10.65,37.5 C40.2 R20.1 R21.2 R24.2
N$48
  Top 0.4: IC3.4 16,36.85 R22.2
N$49  (via drill 1)
  other vias: 85.09,57.15
N$50
  Top 0.4: R18.2 C46.1 45.85,12.75 45,13.6 R17.1
N$51  (1 unrouted)
  Top 0.4: 36.97,51.5 IC5.9
N$52  (1 unrouted)
  Top 0.4: IC5.7 40.33,50.17 40,50.5 40,52
N$54
  Top 0.4: IC1.12 40.27,11.53 40.6,11.2 41.4,11.2 41.85,10.75 C45.1 R18.1
N$55
  Top 0.4: R28.1 34,32 33.5,31.5 33.5,31 | 33.5,31 R30.2 | IC4.6 34.87,30.64 34.5,31 33.5,31
N$56
  Top 0.3: Q2.3 17.9,32.9 18,33 20,33 20.5,32.5 U$5.2
N$57
  Top 0.4: IC4.1 44.45,28.09 R29.1 44.5,26.5 45,26 R15.2
N$58
  Top 0.4: IC2.8 28.28,46.57 R32.2
N$59
  Top 0.4: IC2.5 22.77,38.73 23.5,38 R31.2
N$60  (via drill 1)
  other vias: 64.77,34.29
N$61  (via drill 1)
  other vias: 87.63,57.15
N$62  (via drill 1)
  other vias: 67.31,34.29
N$63  (via drill 1)
  other vias: 67.31,36.83
N$64  (via drill 1)
  other vias: 87.63,59.69
N$65  (via drill 1)
  other vias: 85.09,34.29
N$66  (via drill 1)
  other vias: 87.63,34.29
N$67  (via drill 1)
  other vias: 85.09,59.69
N$68  (via drill 1)
  other vias: 87.63,36.83
N$69  (via drill 1)
  other vias: 85.09,36.83
N$70  (via drill 1)
  other vias: 85.09,39.37
N$71  (via drill 1)
  other vias: 85.09,62.23
N$72  (via drill 1)
  other vias: 87.63,39.37
N$73  (via drill 1)
  other vias: 90.17,39.37
N$74  (via drill 1)
  other vias: 90.17,36.83
N$75  (via drill 1)
  other vias: 90.17,34.29
N$76  (via drill 1)
  other vias: 92.71,34.29
N$77  (via drill 1)
  other vias: 95.25,34.29
N$78  (via drill 1)
  other vias: 95.25,36.83
N$79  (via drill 1)
  other vias: 92.71,36.83
N$80  (via drill 1)
  other vias: 92.71,39.37
N$81  (via drill 1)
  other vias: 95.25,39.37
N$82  (via drill 1)
  other vias: 97.79,39.37
N$83  (via drill 1)
  other vias: 97.79,36.83
N$84  (via drill 1)
  other vias: 97.79,34.29
N$85  (via drill 1)
  other vias: 100.33,34.29
N$86  (via drill 1)
  other vias: 64.77,36.83
N$87  (via drill 1)
  other vias: 64.77,39.37
N$88  (via drill 1)
  other vias: 100.33,36.83
N$89  (via drill 1)
  other vias: 100.33,39.37
N$90  (via drill 1)
  other vias: 67.31,39.37
N$91  (via drill 1)
  other vias: 69.85,39.37
N$92  (via drill 1)
  other vias: 69.85,36.83
N$93  (via drill 1)
  other vias: 69.85,34.29
N$94  (via drill 1)
  other vias: 85.09,26.67
N$95  (via drill 1)
  other vias: 87.63,26.67
N$96  (via drill 1)
  other vias: 87.63,29.21
N$97  (via drill 1)
  other vias: 85.09,29.21
N$98  (via drill 1)
  other vias: 85.09,31.75
N$99  (via drill 1)
  other vias: 87.63,31.75
N$100  (via drill 1)
  other vias: 90.17,31.75
N$101  (via drill 1)
  other vias: 90.17,29.21
N$102  (via drill 1)
  other vias: 72.39,34.29
N$103  (via drill 1)
  other vias: 72.39,36.83
N$104  (via drill 1)
  other vias: 72.39,39.37
N$105  (via drill 1)
  other vias: 95.25,29.21
N$106  (via drill 1)
  other vias: 92.71,29.21
N$107  (via drill 1)
  other vias: 92.71,31.75
N$108  (via drill 1)
  other vias: 95.25,31.75
N$109  (via drill 1)
  other vias: 97.79,31.75
N$110  (via drill 1)
  other vias: 97.79,29.21
N$111  (via drill 1)
  other vias: 97.79,26.67
N$112  (via drill 1)
  other vias: 100.33,26.67
N$113  (via drill 1)
  other vias: 59.69,29.21
N$114  (via drill 1)
  other vias: 57.15,29.21
N$115  (via drill 1)
  other vias: 100.33,29.21
N$116  (via drill 1)
  other vias: 100.33,31.75
N$117  (via drill 1)
  other vias: 57.15,31.75
N$118  (via drill 1)
  other vias: 59.69,31.75
N$119  (via drill 1)
  other vias: 62.23,31.75
N$120  (via drill 1)
  other vias: 62.23,29.21
N$121  (via drill 1)
  other vias: 85.09,19.05
N$122  (via drill 1)
  other vias: 87.63,19.05
N$123  (via drill 1)
  other vias: 87.63,21.59
N$124  (via drill 1)
  other vias: 85.09,21.59
N$125  (via drill 1)
  other vias: 85.09,24.13
N$126  (via drill 1)
  other vias: 87.63,24.13
N$127  (via drill 1)
  other vias: 67.31,29.21
N$128  (via drill 0.35)  (2 unrouted)
  Top 0.4: IC5.11 38.41,48.91 v39,49.5 | IC5.3 40.56,45.09 v39.98,44.52
  Bottom 0.4: v39.98,44.52 39,45.5 v39,49.5
N$129  (via drill 1)
  other vias: 64.77,29.21
N$130  (2 unrouted)
  Top 0.4: IC5.13 38.87,46.37 40.13,47.63 IC5.5
N$131  (via drill 1)
  other vias: 64.77,31.75
N$133  (via drill 1)
  other vias: 67.31,31.75
N$134  (via drill 1)
  other vias: 69.85,31.75
N$135  (via drill 1)
  other vias: 69.85,29.21
N$136  (via drill 1)
  other vias: 97.79,24.13
N$137  (via drill 1)
  other vias: 97.79,21.59
N$138  (via drill 1)
  other vias: 97.79,19.05
N$139  (via drill 1)
  other vias: 100.33,19.05
N$140  (via drill 1)
  other vias: 72.39,29.21
N$141  (via drill 1)
  other vias: 72.39,31.75
N$142  (via drill 1)
  other vias: 100.33,21.59
N$143  (via drill 1)
  other vias: 100.33,24.13
N$144  (via drill 1)
  other vias: 57.15,57.15
N$145  (via drill 1)
  other vias: 87.63,62.23
N$146  (via drill 1)
  other vias: 90.17,62.23
N$147  (via drill 1)
  other vias: 90.17,59.69
N$148  (via drill 1)
  other vias: 90.17,57.15
N$149  (via drill 1)
  other vias: 92.71,57.15
N$150  (via drill 1)
  other vias: 95.25,57.15
N$151  (via drill 1)
  other vias: 95.25,59.69
N$152  (via drill 1)
  other vias: 92.71,59.69
N$153  (via drill 1)
  other vias: 92.71,62.23
N$154  (via drill 1)
  other vias: 95.25,62.23
N$155  (via drill 1)
  other vias: 97.79,62.23
N$156  (via drill 1)
  other vias: 97.79,59.69
N$157  (via drill 1)
  other vias: 97.79,57.15
N$158  (via drill 1)
  other vias: 100.33,57.15
N$159  (via drill 1)
  other vias: 59.69,57.15
N$160  (via drill 1)
  other vias: 59.69,59.69
N$161  (via drill 1)
  other vias: 100.33,59.69
N$162  (via drill 1)
  other vias: 100.33,62.23
N$163  (via drill 1)
  other vias: 57.15,59.69
N$164  (via drill 1)
  other vias: 57.15,62.23
N$165  (via drill 1)
  other vias: 59.69,62.23
N$166  (via drill 1)
  other vias: 62.23,62.23
N$167  (via drill 1)
  other vias: 85.09,49.53
N$168  (via drill 1)
  other vias: 87.63,49.53
N$169  (via drill 1)
  other vias: 87.63,52.07
N$170  (via drill 1)
  other vias: 85.09,52.07
N$171  (via drill 1)
  other vias: 85.09,54.61
N$172  (via drill 1)
  other vias: 87.63,54.61
N$173  (via drill 1)
  other vias: 90.17,54.61
N$174  (via drill 1)
  other vias: 90.17,52.07
N$175  (via drill 1)
  other vias: 90.17,49.53
N$176  (via drill 1)
  other vias: 92.71,49.53
N$177  (via drill 1)
  other vias: 95.25,49.53
N$178  (via drill 1)
  other vias: 95.25,52.07
N$179  (via drill 1)
  other vias: 92.71,52.07
N$180  (via drill 1)
  other vias: 92.71,54.61
N$181  (via drill 1)
  other vias: 95.25,54.61
N$182  (via drill 1)
  other vias: 97.79,54.61
N$183  (via drill 1)
  other vias: 97.79,52.07
N$184  (via drill 1)
  other vias: 97.79,49.53
N$185  (via drill 1)
  other vias: 100.33,49.53
N$186  (via drill 1)
  other vias: 62.23,59.69
N$187  (via drill 1)
  other vias: 62.23,57.15
N$188  (via drill 1)
  other vias: 100.33,52.07
N$189  (via drill 1)
  other vias: 100.33,54.61
N$190  (via drill 1)
  other vias: 64.77,57.15
N$191  (via drill 1)
  other vias: 67.31,57.15
N$192  (via drill 1)
  other vias: 67.31,59.69
N$193  (via drill 1)
  other vias: 64.77,59.69
N$194  (via drill 1)
  other vias: 85.09,41.91
N$195  (via drill 1)
  other vias: 87.63,41.91
N$196  (via drill 1)
  other vias: 87.63,44.45
N$197  (via drill 1)
  other vias: 85.09,44.45
N$198  (via drill 1)
  other vias: 85.09,46.99
N$199  (via drill 1)
  other vias: 87.63,46.99
N$200  (via drill 1)
  other vias: 90.17,46.99
N$201  (via drill 1)
  other vias: 90.17,44.45
N$202  (via drill 1)
  other vias: 90.17,41.91
N$203  (via drill 1)
  other vias: 92.71,41.91
N$204  (via drill 1)
  other vias: 95.25,41.91
N$205  (via drill 1)
  other vias: 95.25,44.45
N$206  (via drill 1)
  other vias: 92.71,44.45
N$207  (via drill 1)
  other vias: 92.71,46.99
N$208  (via drill 1)
  other vias: 95.25,46.99
N$209  (via drill 1)
  other vias: 97.79,46.99
N$210  (via drill 1)
  other vias: 97.79,44.45
N$211  (via drill 1)
  other vias: 97.79,41.91
N$212  (via drill 1)
  other vias: 100.33,41.91
N$213  (via drill 1)
  other vias: 64.77,62.23
N$214  (via drill 1)
  other vias: 67.31,62.23
N$215  (via drill 1)
  other vias: 100.33,44.45
N$216  (via drill 1)
  other vias: 100.33,46.99
N$217  (via drill 1)
  other vias: 69.85,62.23
N$218  (via drill 1)
  other vias: 69.85,59.69
N$219  (via drill 1)
  other vias: 69.85,57.15
N$220  (via drill 1)
  other vias: 72.39,57.15
N$221  (via drill 1)
  other vias: 85.09,67.31
N$222  (via drill 1)
  other vias: 87.63,67.31
N$223  (via drill 1)
  other vias: 87.63,69.85
N$224  (via drill 1)
  other vias: 85.09,69.85
N$225  (via drill 1)
  other vias: 85.09,72.39
N$226  (via drill 1)
  other vias: 87.63,72.39
N$227  (via drill 1)
  other vias: 90.17,72.39
N$228  (via drill 1)
  other vias: 72.39,59.69
N$229  (via drill 1)
  other vias: 72.39,62.23
N$230  (via drill 1)
  other vias: 57.15,49.53
N$231  (via drill 1)
  other vias: 59.69,49.53
N$232  (via drill 1)
  other vias: 59.69,52.07
N$233  (via drill 1)
  other vias: 57.15,52.07
N$234  (via drill 1)
  other vias: 57.15,54.61
N$235  (via drill 1)
  other vias: 95.25,72.39
N$236  (via drill 1)
  other vias: 97.79,72.39
N$237  (via drill 1)
  other vias: 97.79,69.85
N$238  (via drill 1)
  other vias: 97.79,67.31
N$239  (via drill 1)
  other vias: 100.33,67.31
N$240  (via drill 1)
  other vias: 59.69,54.61
N$241  (via drill 1)
  other vias: 62.23,54.61
N$242  (via drill 1)
  other vias: 100.33,69.85
N$243  (via drill 1)
  other vias: 100.33,72.39
N$244  (via drill 1)
  other vias: 62.23,52.07
N$245  (via drill 1)
  other vias: 62.23,49.53
N$246  (via drill 1)
  other vias: 85.09,64.77
N$247  (via drill 1)
  other vias: 87.63,64.77
N$248  (via drill 1)
  other vias: 90.17,64.77
N$249  (via drill 1)
  other vias: 92.71,64.77
N$250  (via drill 1)
  other vias: 95.25,64.77
N$251  (via drill 1)
  other vias: 97.79,64.77
N$252  (via drill 1)
  other vias: 100.33,64.77
N$253  (via drill 1)
  other vias: 64.77,49.53
N$254  (via drill 1)
  other vias: 67.31,49.53
N$255  (via drill 1)
  other vias: 92.71,74.93
N$256  (via drill 1)
  other vias: 67.31,52.07
N$257  (via drill 1)
  other vias: 97.79,74.93
N$258  (via drill 1)
  other vias: 100.33,74.93
N$259  (via drill 1)
  other vias: 64.77,52.07
N$260  (via drill 1)
  other vias: 64.77,54.61
N$261  (via drill 1)
  other vias: 67.31,54.61
N$262  (via drill 1)
  other vias: 69.85,54.61
N$263  (via drill 1)
  other vias: 69.85,52.07
N$264  (via drill 1)
  other vias: 69.85,49.53
N$265  (via drill 1)
  other vias: 72.39,49.53
N$266  (via drill 1)
  other vias: 72.39,52.07
N$267  (via drill 1)
  other vias: 72.39,54.61
N$268  (via drill 1)
  other vias: 57.15,41.91
N$269  (via drill 1)
  other vias: 59.69,41.91
N$270  (via drill 1)
  other vias: 59.69,44.45
N$271  (via drill 1)
  other vias: 57.15,44.45
N$272  (via drill 1)
  other vias: 57.15,46.99
N$273  (via drill 1)
  other vias: 59.69,46.99
N$274  (via drill 1)
  other vias: 62.23,46.99
N$275  (via drill 1)
  other vias: 62.23,44.45
N$276  (via drill 1)
  other vias: 62.23,41.91
N$277  (via drill 1)
  other vias: 64.77,41.91
N$278  (via drill 1)
  other vias: 67.31,41.91
N$279  (via drill 1)
  other vias: 67.31,44.45
N$280  (via drill 1)
  other vias: 64.77,44.45
N$281  (via drill 1)
  other vias: 64.77,46.99
N$282  (via drill 1)
  other vias: 67.31,46.99
N$283  (via drill 1)
  other vias: 69.85,46.99
N$284  (via drill 1)
  other vias: 69.85,44.45
N$285  (via drill 1)
  other vias: 69.85,41.91
N$286  (via drill 1)
  other vias: 72.39,41.91
N$287  (via drill 1)
  other vias: 72.39,44.45
N$288  (via drill 1)
  other vias: 72.39,46.99
N$289  (via drill 1)
  other vias: 57.15,64.77
N$290  (via drill 1)
  other vias: 59.69,64.77
N$291  (via drill 1)
  other vias: 62.23,64.77
N$292  (via drill 1)
  other vias: 64.77,64.77
N$293  (via drill 1)
  other vias: 67.31,64.77
N$294  (via drill 1)
  other vias: 69.85,64.77
N$295  (via drill 1)
  other vias: 72.39,64.77
N$296  (via drill 1)
  other vias: 57.15,67.31
N$298  (via drill 1)
  other vias: 59.69,69.85
N$300  (via drill 1)
  other vias: 57.15,72.39
N$301  (via drill 1)
  other vias: 59.69,72.39
N$311  (via drill 1)
  other vias: 69.85,72.39
N$312  (via drill 1)
  other vias: 69.85,69.85
N$313  (via drill 1)
  other vias: 69.85,67.31
N$314  (via drill 1)
  other vias: 72.39,67.31
N$315  (via drill 1)
  other vias: 72.39,69.85
N$316  (via drill 1)
  other vias: 72.39,72.39
N$317  (via drill 1)
  other vias: 57.15,74.93
N$318  (via drill 1)
  other vias: 59.69,74.93
N$322  (via drill 1)
  other vias: 69.85,74.93
N$323  (via drill 1)
  other vias: 72.39,74.93
N$324  (via drill 1)
  other vias: 57.15,19.05
N$325  (via drill 1)
  other vias: 59.69,19.05
N$326  (via drill 1)
  other vias: 59.69,21.59
N$327  (via drill 1)
  other vias: 57.15,21.59
N$328  (via drill 1)
  other vias: 57.15,24.13
N$329  (via drill 1)
  other vias: 59.69,24.13
N$339  (via drill 1)
  other vias: 69.85,24.13
N$340  (via drill 1)
  other vias: 69.85,21.59
N$341  (via drill 1)
  other vias: 69.85,19.05
N$342  (via drill 1)
  other vias: 72.39,19.05
N$343  (via drill 1)
  other vias: 72.39,21.59
N$344  (via drill 1)
  other vias: 72.39,24.13
N$345  (via drill 1)
  other vias: 57.15,26.67
N$346  (via drill 1)
  other vias: 59.69,26.67
N$350  (via drill 1)
  other vias: 69.85,26.67
N$351  (via drill 1)
  other vias: 72.39,26.67
N$2992  (via drill 1)  (1 unrouted)
  other vias: 57.15,69.85 59.69,67.31
NOFILL
  cutout Top: 31,7 49,7 49,67 31,67
  cutout Bottom: 31,7 49,7 49,67 31,67
  cutout Route15: 31,7 49,7 49,67 31,67
  cutout Route2: 31,7 49,7 49,67 31,67
SPI_MCS_CLK
  Top 0.3: U$7.14 13.75,20.37 14.38,21 17.73,21 SV4.7
SPI_MCS_CS
  Top 0.3: U$7.13 19.21,19.94 SV4.5
SPI_MCS_MISO
  Top 0.3: U$7.15 13.25,20.75 14,21.5 15.69,21.5 SV4.9
TST1  (via drill 1)
  Top 0.8: TST1.1 v92.71,67.31 | v90.17,67.31 v92.71,67.31 | v92.71,67.31 v95.25,67.31
TST2  (via drill 1)
  Top 0.8: TST2.1 v92.71,26.67 | v92.71,26.67 v90.17,26.67 | v92.71,26.67 v95.25,26.67
TST4  (via drill 1)
  Top 0.8: TST4.1 v64.77,26.67 | v64.77,26.67 v62.23,26.67 | v64.77,26.67 v67.31,26.67
VCCADC
  Top 0.3: C31.1 12.75,22.4 U$7.16
  Top 1: L4.1 11,27.5 JP1.1 12.55,27.18 C30.1 12.55,22.6 C31.1
VDD_DC
  pour Top (no thermals): 22,58 22.5,58.5 22.5,62 22,62.5 13,62.5 12.5,63 12,63 11.5,62.5 11.5,61 12,60.5 17,60.5 17.5,60 17.5,58.5 18,58
VREG_VDD3V3_EN
  Top 0.4: U$3.5 9.95,59.75 10.4,60.2 10.4,62.15 R5.1

### Text on the board
Route2: GND | +3V3 | GND | +3V3